# EAGLE design led_mask (EAGLE 6.3)
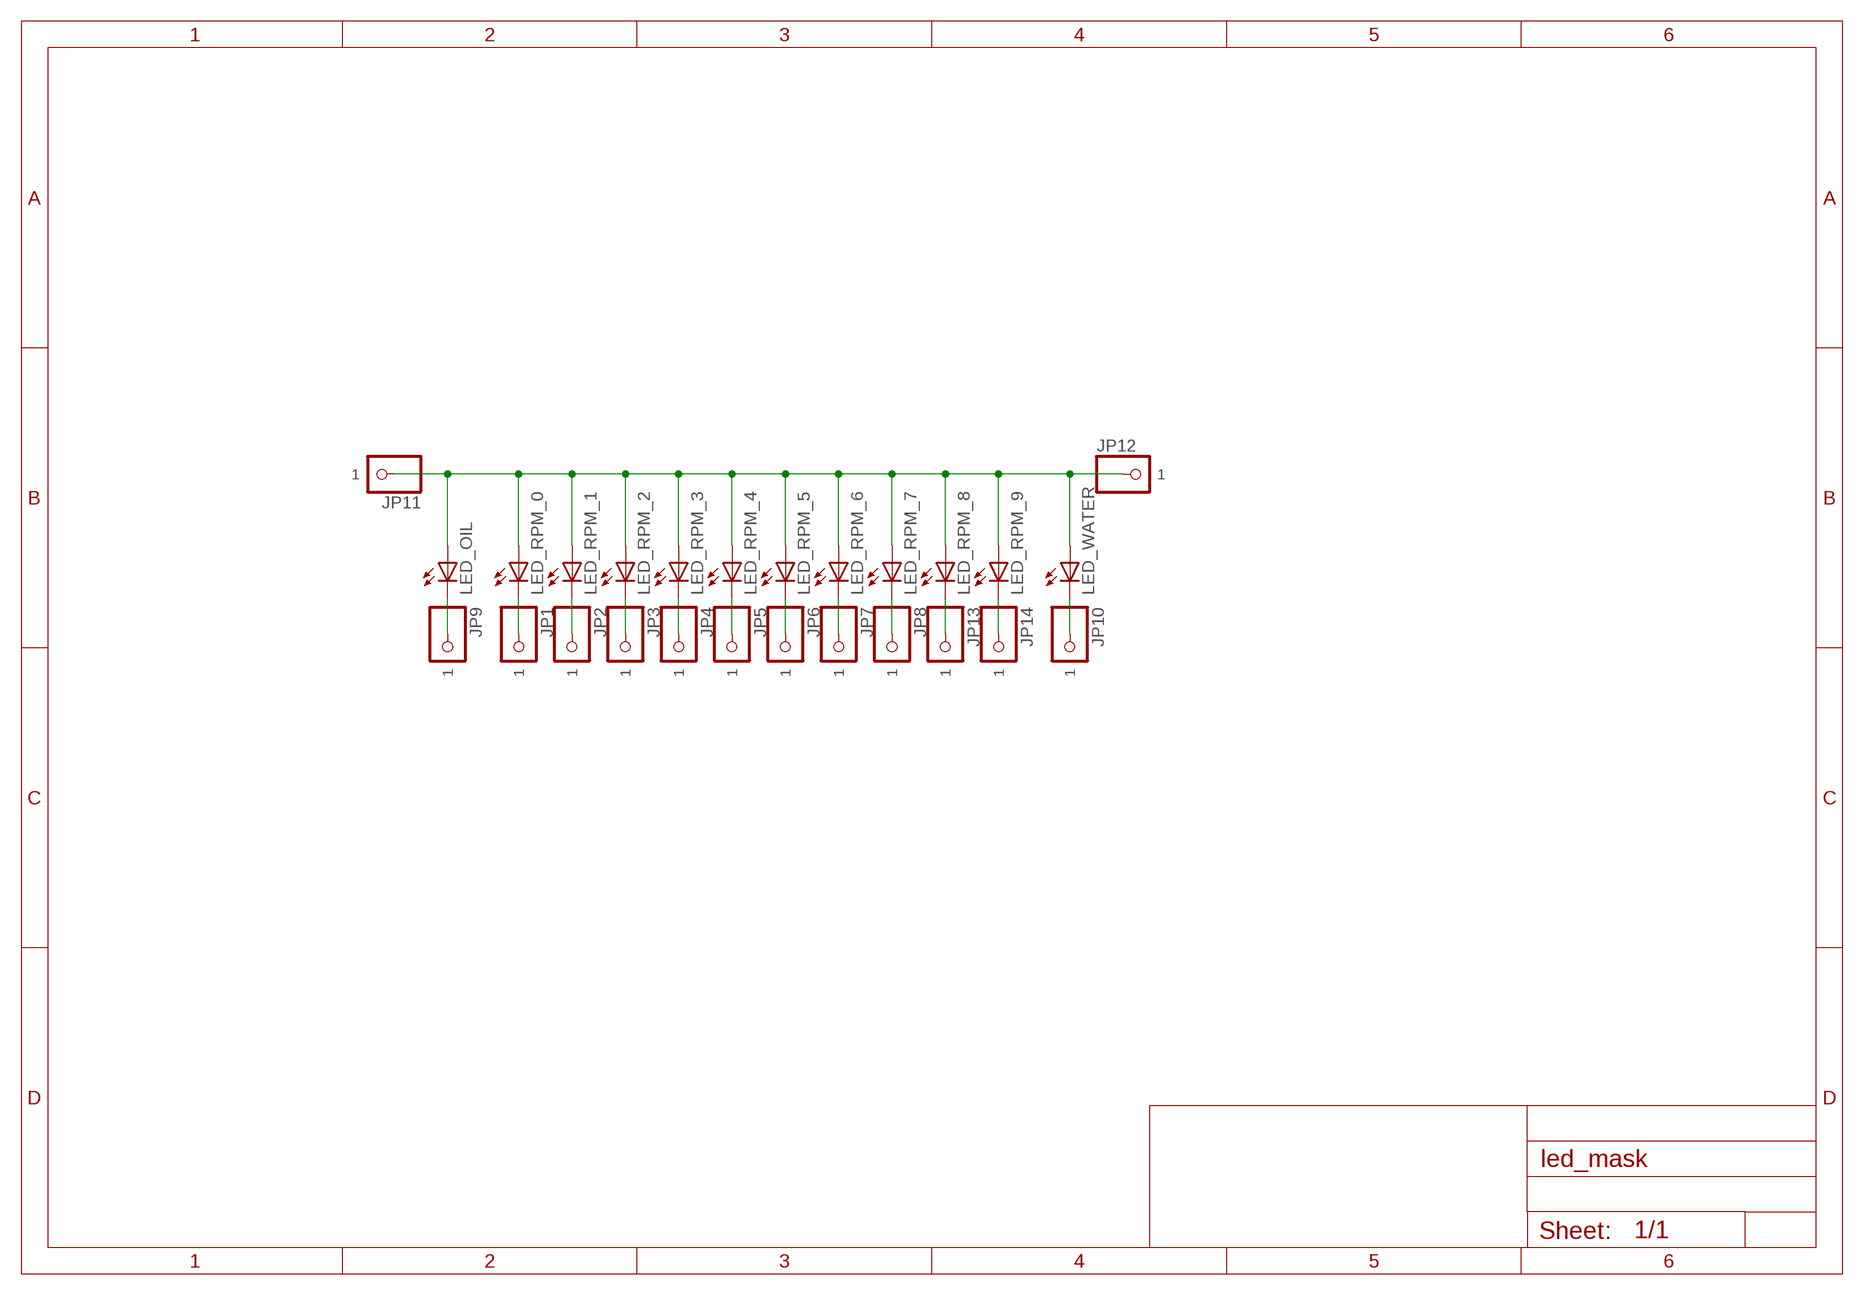
[diagram p0: schematic, sheet 1]

## Parts
JP1  PINHD-1X11.5X2.5MM_SMD  [1XSMD1.5X2.5MM]
JP2  PINHD-1X11.5X2.5MM_SMD  [1XSMD1.5X2.5MM]
JP3  PINHD-1X11.5X2.5MM_SMD  [1XSMD1.5X2.5MM]
JP4  PINHD-1X11.5X2.5MM_SMD  [1XSMD1.5X2.5MM]
JP5  PINHD-1X11.5X2.5MM_SMD  [1XSMD1.5X2.5MM]
JP6  PINHD-1X11.5X2.5MM_SMD  [1XSMD1.5X2.5MM]
JP7  PINHD-1X11.5X2.5MM_SMD  [1XSMD1.5X2.5MM]
JP8  PINHD-1X11.5X2.5MM_SMD  [1XSMD1.5X2.5MM]
JP9  PINHD-1X11.5X2.5MM_SMD  [1XSMD1.5X2.5MM]
JP10  PINHD-1X11.5X2.5MM_SMD  [1XSMD1.5X2.5MM]
JP11  PINHD-1X11.5X2.5MM_SMD  [1XSMD1.5X2.5MM]
JP12  PINHD-1X11.5X2.5MM_SMD  [1XSMD1.5X2.5MM]
JP13  PINHD-1X11.5X2.5MM_SMD  [1XSMD1.5X2.5MM]
JP14  PINHD-1X11.5X2.5MM_SMD  [1XSMD1.5X2.5MM]
LED_OIL  LED3MM  [LED3MM]
LED_RPM_0  LED3MM  [LED3MM]
LED_RPM_1  LED3MM  [LED3MM]
LED_RPM_2  LED3MM  [LED3MM]
LED_RPM_3  LED3MM  [LED3MM]
LED_RPM_4  LED3MM  [LED3MM]
LED_RPM_5  LED3MM  [LED3MM]
LED_RPM_6  LED3MM  [LED3MM]
LED_RPM_7  LED3MM  [LED3MM]
LED_RPM_8  LED3MM  [LED3MM]
LED_RPM_9  LED3MM  [LED3MM]
LED_WATER  LED3MM  [LED3MM]

## Nets
N$1: JP11.P$1 JP12.P$1 LED_OIL.A LED_RPM_0.A LED_RPM_1.A LED_RPM_2.A LED_RPM_3.A LED_RPM_4.A LED_RPM_5.A LED_RPM_6.A LED_RPM_7.A LED_RPM_8.A LED_RPM_9.A LED_WATER.A
N$2: JP3.P$1 LED_RPM_2.K(C)
N$3: JP1.P$1 LED_RPM_0.K(C)
N$4: JP2.P$1 LED_RPM_1.K(C)
N$5: JP4.P$1 LED_RPM_3.K(C)
N$6: JP5.P$1 LED_RPM_4.K(C)
N$7: JP6.P$1 LED_RPM_5.K(C)
N$8: JP7.P$1 LED_RPM_6.K(C)
N$9: JP8.P$1 LED_RPM_7.K(C)
N$10: JP9.P$1 LED_OIL.K(C)
N$11: JP10.P$1 LED_WATER.K(C)
N$12: JP13.P$1 LED_RPM_8.K(C)
N$13: JP14.P$1 LED_RPM_9.K(C)

## Library data of the parts
JP1-JP14 = pinhead:PINHD-1X1: PIN HEADER
LED_OIL LED_RPM_0 LED_RPM_1-LED_RPM_9 LED_WATER = led:LED: LED OSRAM: - CHIPLED LG R971, LG N971, LY N971, LG Q971, LY Q971, LO R971, LY R971 LH N974, LH R974 LS Q976, LO Q976, LY Q976 LO Q996 - Hyper CHIPLED LW Q18S LB Q993, LB Q99A, LB R99A - SideLED LS A670, LO A670, LY A670, LG A670, LP A670 LB A673, LV A673, LT A673, LW A673 LH A674 LY A675 LS A676, LA A676, LO A676, LY A676, LW A676 LS A679, LY A679, LG A679 - Hyper Micro SIDELED® LS Y876, LA Y876, LO Y876, LY Y876 LT Y87S - SmartLED LW L88C, LW L88S LB L89C, LB L89S, LG L890 LS L89K, LO L89K, LY L89K LS L896, LA L896, LO L896, LY L896 - TOPLED LS T670, LO T670, LY T670, LG T670, LP T670 LSG T670, LSP T670, LSY T670, LOP T670, LYG T670 LG T671, LOG T671, LSG T671 LB T673, LV T673, LT T673, LW T673 LH T674 LS T676, LA T676, LO T676, LY T676, LB T676, LH T676, LSB T676, LW T676 LB T67C, LV T67C, LT T67C, LS T67K, LO T67K, LY T67K, LW E67C LS E67B, LA E67B, LO E67B, LY E67B, LB E67C, LV E67C, LT E67C LW T67C LS T679, LY T679, LG T679 LS T770, LO T770, LY T770, LG T770, LP T770 LB T773, LV T773, LT T773, LW T773 LH T774 LS E675, LA E675, LY E675, LS T675 LS T776, LA T776, LO T776, LY T776, LB T776 LHGB T686 LT T68C, LB T68C - Hyper Mini TOPLED® LB M676 - Mini TOPLED Santana® LG M470 LS M47K, LO M47K, LY M47K Source: http://www.osram.convergy.de LUXEON: - LUMILED® LXK2-PW12-R00, LXK2-PW12-S00, LXK2-PW14-U00, LXK2-PW14-V00 LXK2-PM12-R00, LXK2-PM12-S00, LXK2-PM14-U00 LXK2-PE12-Q00, LXK2-PE12-R00, LXK2-PE12-S00, LXK2-PE14-T00, LXK2-PE14-U00 LXK2-PB12-K00, LXK2-PB12-L00, LXK2-PB12-M00, LXK2-PB14-N00, LXK2-PB14-P00, LXK2-PB14-Q00 LXK2-PR12-L00, LXK2-PR12-M00, LXK2-PR14-Q00, LXK2-PR14-R00 LXK2-PD12-Q00, LXK2-PD12-R00, LXK2-PD12-S00 LXK2-PH12-R00, LXK2-PH12-S00 LXK2-PL12-P00, LXK2-PL12-Q00, LXK2-PL12-R00 Source: www.luxeon.com KINGBRIGHT: KA-3528ASYC Source: www.kingbright.com

## Board
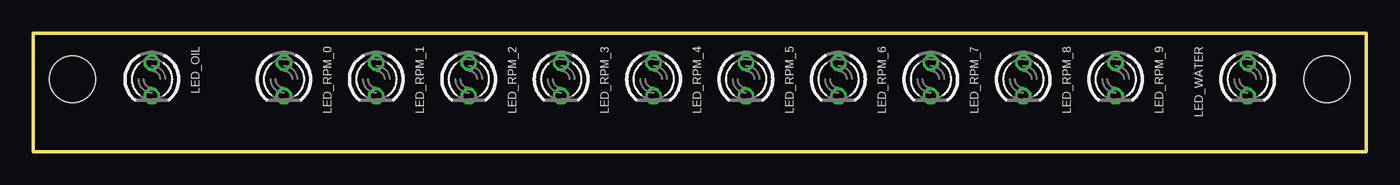
[diagram p1: board, top side]
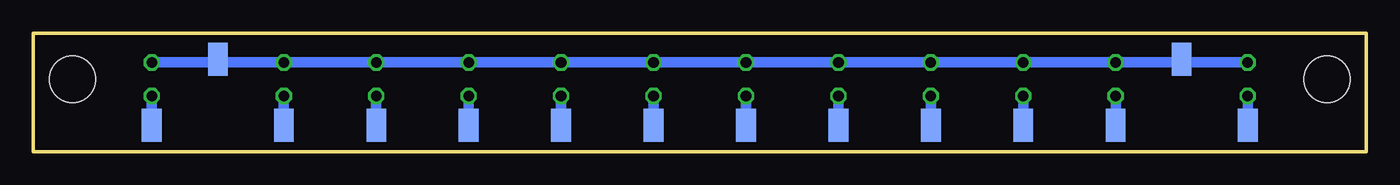
[diagram p2: board, bottom side, seen from below]

Size 101 x 9 mm. Coordinates in mm from the lower left corner, seen from the top.
Outline: 0,0 0,9 101,9 101,0 0,0
Copper layers (1*16): Top 0.0356mm / dielectric 1.5011mm / Bottom 0.0356mm
Design rules "oshPark2Layer": minimum track width 6mil, minimum drill 13mil, track to track 6mil, track to pad 6mil, pad to pad 6mil, via to via 6mil, smd to smd 6mil, copper to edge 15mil, drill to drill 6mil, minimum pad ring 7mil, minimum via ring 7mil, stop-mask expansion 3mil, vias tented up to drill 0mil, thermal gap 10mil
Holes 3.5 mm at 3,5.5 98,5.5

### Footprints (pad centres in the part's own frame; a part is rotated, then mirrored left to right if it is on the bottom)
1XSMD1.5X2.5MM = smd 1.5 x 2.5: P$1 0,0
LED3MM = drill 0.813 octagon: A -1.27,0; K 1.27,0

### Placement (x,y rotation side)
JP1  19,2 0 bottom
JP2  26,2 0 bottom
JP3  33,2 0 bottom
JP4  40,2 0 bottom
JP5  47,2 0 bottom
JP6  54,2 0 bottom
JP7  61,2 0 bottom
JP8  68,2 0 bottom
JP9  9,2 0 bottom
JP10  92,2 0 bottom
JP11  14,7 0 bottom
JP12  87,7 180 bottom
JP13  75,2 0 bottom
JP14  82,2 0 bottom
LED_OIL  9,5.5 270 top
LED_RPM_0  19,5.5 270 top
LED_RPM_1  26,5.5 270 top
LED_RPM_2  33,5.5 270 top
LED_RPM_3  40,5.5 270 top
LED_RPM_4  47,5.5 270 top
LED_RPM_5  54,5.5 270 top
LED_RPM_6  61,5.5 270 top
LED_RPM_7  68,5.5 270 top
LED_RPM_8  75,5.5 270 top
LED_RPM_9  82,5.5 270 top
LED_WATER  92,5.5 270 top

### Tracks (layer width: path | path; a pad name or v marks a point on that pad's centre or on a via)
N$1
  Bottom 0.813: LED_WATER.A 87,6.77 | 87,6.77 LED_RPM_9.A | 87,6.77 JP12.P$1 86.77,6.77 LED_RPM_9.A | 14,6.77 LED_RPM_0.A LED_RPM_1.A LED_RPM_2.A LED_RPM_3.A LED_RPM_4.A LED_RPM_5.A LED_RPM_6.A LED_RPM_7.A LED_RPM_8.A LED_RPM_9.A | 14,6.77 LED_OIL.A | JP11.P$1 14,6.77
N$2
  Bottom 0.813: JP3.P$1 LED_RPM_2.K
N$3
  Bottom 0.813: JP1.P$1 LED_RPM_0.K
N$4
  Bottom 0.813: JP2.P$1 LED_RPM_1.K
N$5
  Bottom 0.813: JP4.P$1 LED_RPM_3.K
N$6
  Bottom 0.813: JP5.P$1 LED_RPM_4.K
N$7
  Bottom 0.813: JP6.P$1 LED_RPM_5.K
N$8
  Bottom 0.813: JP7.P$1 LED_RPM_6.K
N$9
  Bottom 0.813: JP8.P$1 LED_RPM_7.K
N$10
  Bottom 0.813: JP9.P$1 LED_OIL.K
N$11
  Bottom 0.813: JP10.P$1 LED_WATER.K
N$12
  Bottom 0.813: JP13.P$1 LED_RPM_8.K
N$13
  Bottom 0.813: JP14.P$1 LED_RPM_9.K